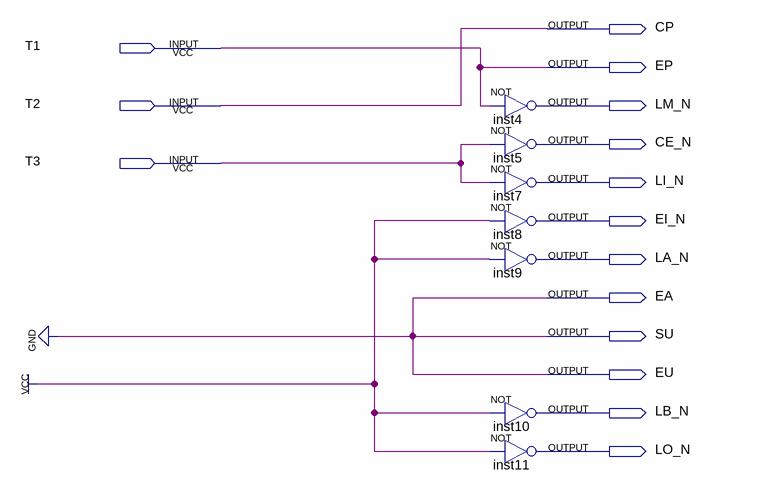
[diagram p0: schematic sheet]
// Quartus schematic Fetch.bdf as structural Verilog: 7 symbols, 15 pins
module Fetch (
  input  T1,
  input  T2,
  input  T3,
  output CP,
  output EP,
  output LM_N,
  output CE_N,
  output LI_N,
  output EI_N,
  output LA_N,
  output EA,
  output SU,
  output EU,
  output LB_N,
  output LO_N
);

  not inst4 (LM_N, T1);
  not inst5 (CE_N, T3);
  not inst7 (LI_N, T3);
  not inst8 (EI_N, 1'b1);
  not inst9 (LA_N, 1'b1);
  not inst10 (LB_N, 1'b1);
  not inst11 (LO_N, 1'b1);

  assign CP = T2;
  assign EA = 1'b0;
  assign EP = T1;
  assign EU = 1'b0;
  assign SU = 1'b0;
endmodule
